# EAGLE schematic led_2 (EAGLE 9.4.1)
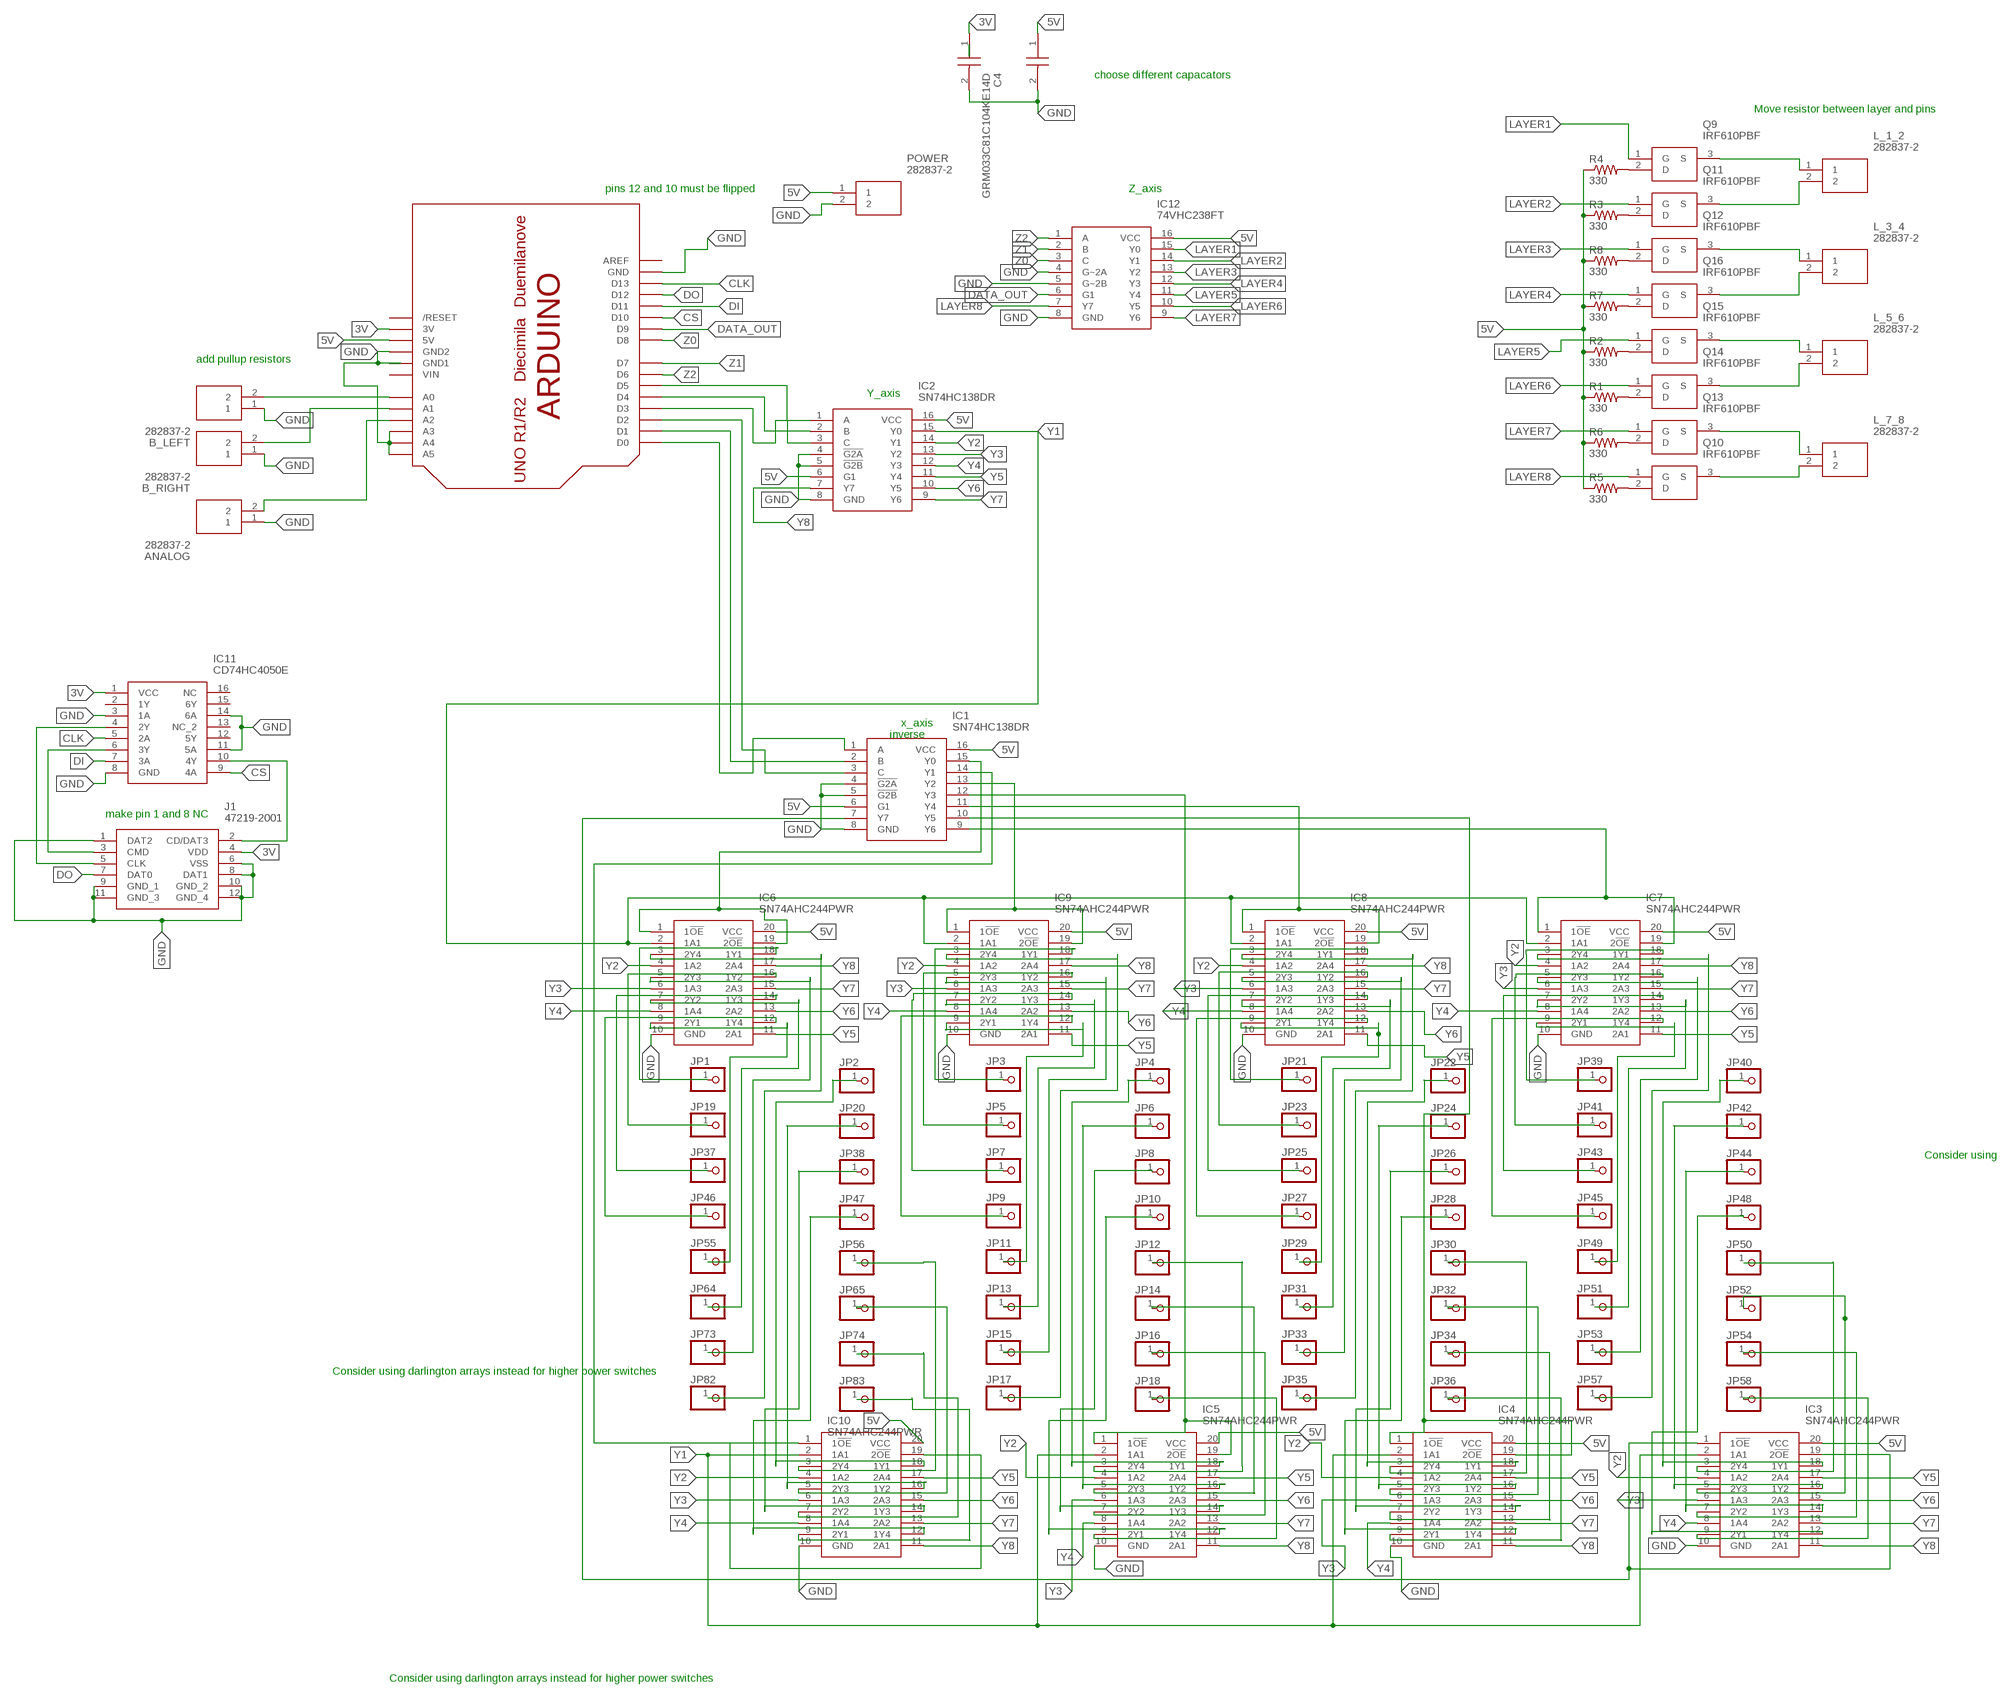
[diagram p0: schematic, sheet 1, part 1 of 2]
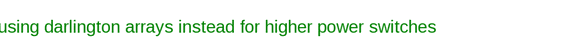
[diagram p1: schematic, sheet 1, part 2 of 2]

## Parts
ANALOG  282837-2  [SHDR2W100P0X508_1X2_1016X820X1]
B_LEFT  282837-2  [SHDR2W100P0X508_1X2_1016X820X1]
B_RIGHT  282837-2  [SHDR2W100P0X508_1X2_1016X820X1]
C4  GRM033C81C104KE14D  [CAPC0603X33N]
C5  GRM033C81C104KE14D  [CAPC0603X33N]
IC1  SN74HC138DR  [SOIC127P600X175-16N]
IC2  SN74HC138DR  [SOIC127P600X175-16N]
IC3  SN74AHC244PWR  [SOP65P640X120-20N]
IC4  SN74AHC244PWR  [SOP65P640X120-20N]
IC5  SN74AHC244PWR  [SOP65P640X120-20N]
IC6  SN74AHC244PWR  [SOP65P640X120-20N]
IC7  SN74AHC244PWR  [SOP65P640X120-20N]
IC8  SN74AHC244PWR  [SOP65P640X120-20N]
IC9  SN74AHC244PWR  [SOP65P640X120-20N]
IC10  SN74AHC244PWR  [SOP65P640X120-20N]
IC11  CD74HC4050E  [DIP254P762X508-16]
IC12  74VHC238FT  [SOP65P640X120-16N]
J1  47219-2001  [472192001]
JP1  PINHD-1X1  [1X01]
JP2  PINHD-1X1  [1X01]
JP3  PINHD-1X1  [1X01]
JP4  PINHD-1X1  [1X01]
JP5  PINHD-1X1  [1X01]
JP6  PINHD-1X1  [1X01]
JP7  PINHD-1X1  [1X01]
JP8  PINHD-1X1  [1X01]
JP9  PINHD-1X1  [1X01]
JP10  PINHD-1X1  [1X01]
JP11  PINHD-1X1  [1X01]
JP12  PINHD-1X1  [1X01]
JP13  PINHD-1X1  [1X01]
JP14  PINHD-1X1  [1X01]
JP15  PINHD-1X1  [1X01]
JP16  PINHD-1X1  [1X01]
JP17  PINHD-1X1  [1X01]
JP18  PINHD-1X1  [1X01]
JP19  PINHD-1X1  [1X01]
JP20  PINHD-1X1  [1X01]
JP21  PINHD-1X1  [1X01]
JP22  PINHD-1X1  [1X01]
JP23  PINHD-1X1  [1X01]
JP24  PINHD-1X1  [1X01]
JP25  PINHD-1X1  [1X01]
JP26  PINHD-1X1  [1X01]
JP27  PINHD-1X1  [1X01]
JP28  PINHD-1X1  [1X01]
JP29  PINHD-1X1  [1X01]
JP30  PINHD-1X1  [1X01]
JP31  PINHD-1X1  [1X01]
JP32  PINHD-1X1  [1X01]
JP33  PINHD-1X1  [1X01]
JP34  PINHD-1X1  [1X01]
JP35  PINHD-1X1  [1X01]
JP36  PINHD-1X1  [1X01]
JP37  PINHD-1X1  [1X01]
JP38  PINHD-1X1  [1X01]
JP39  PINHD-1X1  [1X01]
JP40  PINHD-1X1  [1X01]
JP41  PINHD-1X1  [1X01]
JP42  PINHD-1X1  [1X01]
JP43  PINHD-1X1  [1X01]
JP44  PINHD-1X1  [1X01]
JP45  PINHD-1X1  [1X01]
JP46  PINHD-1X1  [1X01]
JP47  PINHD-1X1  [1X01]
JP48  PINHD-1X1  [1X01]
JP49  PINHD-1X1  [1X01]
JP50  PINHD-1X1  [1X01]
JP51  PINHD-1X1  [1X01]
JP52  PINHD-1X1  [1X01]
JP53  PINHD-1X1  [1X01]
JP54  PINHD-1X1  [1X01]
JP55  PINHD-1X1  [1X01]
JP56  PINHD-1X1  [1X01]
JP57  PINHD-1X1  [1X01]
JP58  PINHD-1X1  [1X01]
JP64  PINHD-1X1  [1X01]
JP65  PINHD-1X1  [1X01]
JP73  PINHD-1X1  [1X01]
JP74  PINHD-1X1  [1X01]
JP82  PINHD-1X1  [1X01]
JP83  PINHD-1X1  [1X01]
L_1_2  282837-2  [SHDR2W100P0X508_1X2_1016X820X1]
L_3_4  282837-2  [SHDR2W100P0X508_1X2_1016X820X1]
L_5_6  282837-2  [SHDR2W100P0X508_1X2_1016X820X1]
L_7_8  282837-2  [SHDR2W100P0X508_1X2_1016X820X1]
POWER  282837-2  [SHDR2W100P0X508_1X2_1016X820X1]
Q9  IRF610PBF  [TO254P465X1024X2050-3P]
Q10  IRF610PBF  [TO254P465X1024X2050-3P]
Q11  IRF610PBF  [TO254P465X1024X2050-3P]
Q12  IRF610PBF  [TO254P465X1024X2050-3P]
Q13  IRF610PBF  [TO254P465X1024X2050-3P]
Q14  IRF610PBF  [TO254P465X1024X2050-3P]
Q15  IRF610PBF  [TO254P465X1024X2050-3P]
Q16  IRF610PBF  [TO254P465X1024X2050-3P]
R1  330  R-US_0207/12  [0207/12]
R2  330  R-US_0207/12  [0207/12]
R3  330  R-US_0207/12  [0207/12]
R4  330  R-US_0207/12  [0207/12]
R5  330  R-US_0207/12  [0207/12]
R6  330  R-US_0207/12  [0207/12]
R7  330  R-US_0207/12  [0207/12]
R8  330  R-US_0207/12  [0207/12]
U$2  ARDUINO-NOHOLE  [ARDUINO-NOHOLE]

## Nets
3V: C4.1 IC11.1(VCC) J1.4(VDD) U$2.3V
5V [VCC]: C5.1 IC1.6(G1) IC1.16(VCC) IC2.6(G1) IC2.16(VCC) IC3.20(VCC) IC4.20(VCC) IC5.20(VCC) IC6.20(VCC) IC7.20(VCC) IC8.20(VCC) IC9.20(VCC) IC10.20(VCC) IC12.16(VCC) POWER.1 R1.1 R2.1 R3.1 R4.1 R5.1 R6.1 R7.1 R8.1 U$2.5V
CLK: IC11.5(2A) U$2.D13
CS: IC11.9(4A) U$2.D10
DATA_OUT: IC12.6(G1) U$2.D9
DI: IC11.7(3A) U$2.D11
DO: J1.7(DAT0) U$2.D12
GND: ANALOG.1 B_LEFT.1 B_RIGHT.1 C4.2 C5.2 IC1.4(!G2A) IC1.5(!G2B) IC1.8(GND) IC2.4(!G2A) IC2.5(!G2B) IC2.8(GND) IC3.10(GND) IC4.10(GND) IC5.10(GND) IC6.10(GND) IC7.10(GND) IC8.10(GND) IC9.10(GND) IC10.10(GND) IC11.3(1A) IC11.8(GND) IC11.11(5A) IC11.14(6A) IC12.4(G~2A) IC12.5(G~2B) IC12.8(GND) J1.1(DAT2) J1.6(VSS) J1.8(DAT1) J1.9(GND_1) J1.10(GND_2) J1.11(GND_3) J1.12(GND_4) POWER.2 U$2.A3 U$2.A4 U$2.A5 U$2.GND U$2.GND1 U$2.GND2
LAYER1: IC12.15(Y0) Q9.1(G)
LAYER2: IC12.14(Y1) Q11.1(G)
LAYER3: IC12.13(Y2) Q12.1(G)
LAYER4: IC12.12(Y3) Q16.1(G)
LAYER5: IC12.11(Y4) Q15.1(G)
LAYER6: IC12.10(Y5) Q14.1(G)
LAYER7: IC12.9(Y6) Q13.1(G)
LAYER8: IC12.7(Y7) Q10.1(G)
N$1: IC1.9(Y6) IC7.1(1!OE) IC7.19(2!OE)
N$2: IC2.3(C) U$2.D5
N$3: IC6.18(1Y1) JP1.1
N$4: IC2.2(B) U$2.D4
N$5 [VCC]: IC6.16(1Y2) JP19.1
N$6 [VCC]: IC6.14(1Y3) JP37.1
N$7 [VCC]: IC6.12(1Y4) JP46.1
N$8 [VCC]: IC6.9(2Y1) JP55.1
N$9 [VCC]: IC6.7(2Y2) JP64.1
N$10 [VCC]: IC6.5(2Y3) JP73.1
N$11: IC2.1(A) U$2.D3
N$12: IC1.3(C) U$2.D2
N$13: IC1.2(B) U$2.D1
N$14: IC1.1(A) U$2.D0
N$15: B_LEFT.2 U$2.A0
N$16: Q9.2(D) R4.2
N$17: Q11.2(D) R3.2
N$18: Q12.2(D) R8.2
N$19: Q16.2(D) R7.2
N$20: Q15.2(D) R2.2
N$21: Q14.2(D) R1.2
N$22: Q13.2(D) R6.2
N$23: Q10.2(D) R5.2
N$24: L_1_2.1 Q9.3(S)
N$25: L_1_2.2 Q11.3(S)
N$26: L_3_4.1 Q12.3(S)
N$27: L_3_4.2 Q16.3(S)
N$28: L_5_6.1 Q15.3(S)
N$29: L_5_6.2 Q14.3(S)
N$30: L_7_8.1 Q13.3(S)
N$31: L_7_8.2 Q10.3(S)
N$32 [VCC]: IC6.3(2Y4) JP82.1
N$33 [VCC]: IC10.18(1Y1) JP2.1
N$34 [VCC]: IC10.16(1Y2) JP20.1
N$35 [VCC]: IC10.14(1Y3) JP38.1
N$36 [VCC]: IC10.12(1Y4) JP47.1
N$37 [VCC]: IC10.3(2Y4) JP56.1
N$38 [VCC]: IC10.5(2Y3) JP65.1
N$39 [VCC]: IC10.7(2Y2) JP74.1
N$40 [VCC]: IC10.9(2Y1) JP83.1
N$41 [VCC]: IC9.18(1Y1) JP3.1
N$42 [VCC]: IC9.16(1Y2) JP5.1
N$43 [VCC]: IC9.14(1Y3) JP7.1
N$44 [VCC]: IC9.12(1Y4) JP9.1
N$45 [VCC]: IC9.9(2Y1) JP11.1
N$46 [VCC]: IC9.7(2Y2) JP13.1
N$47 [VCC]: IC9.5(2Y3) JP15.1
N$48 [VCC]: IC9.3(2Y4) JP17.1
N$49 [VCC]: IC5.18(1Y1) JP4.1
N$50 [VCC]: IC5.16(1Y2) JP6.1
N$51 [VCC]: IC5.14(1Y3) JP8.1
N$52 [VCC]: IC5.12(1Y4) JP10.1
N$53: IC5.3(2Y4) JP12.1
N$54 [VCC]: IC5.5(2Y3) JP14.1
N$55 [VCC]: IC5.7(2Y2) JP16.1
N$56 [VCC]: IC5.9(2Y1) JP18.1
N$57: IC8.18(1Y1) JP21.1
N$58 [VCC]: IC8.16(1Y2) JP23.1
N$59 [VCC]: IC8.14(1Y3) JP25.1
N$60 [VCC]: IC8.12(1Y4) JP27.1
N$61 [VCC]: IC8.9(2Y1) JP29.1
N$62 [VCC]: IC8.7(2Y2) JP31.1
N$63 [VCC]: IC8.5(2Y3) JP33.1
N$64 [VCC]: IC8.3(2Y4) JP35.1
N$65 [VCC]: IC4.18(1Y1) JP22.1
N$66 [VCC]: IC4.16(1Y2) JP24.1
N$67 [VCC]: IC4.14(1Y3) JP26.1
N$68 [VCC]: IC4.12(1Y4) JP28.1
N$69 [VCC]: IC4.3(2Y4) JP30.1
N$70 [VCC]: IC4.5(2Y3) JP32.1
N$71 [VCC]: IC4.7(2Y2) JP34.1
N$72 [VCC]: IC4.9(2Y1) JP36.1
N$73 [VCC]: IC7.18(1Y1) JP39.1
N$74 [VCC]: IC7.16(1Y2) JP41.1
N$75 [VCC]: IC7.14(1Y3) JP43.1
N$76 [VCC]: IC7.12(1Y4) JP45.1
N$77 [VCC]: IC7.9(2Y1) JP49.1
N$78 [VCC]: IC7.7(2Y2) JP51.1
N$79 [VCC]: IC7.5(2Y3) JP53.1
N$80 [VCC]: IC7.3(2Y4) JP57.1
N$81 [VCC]: IC3.18(1Y1) JP40.1
N$82 [VCC]: IC3.16(1Y2) JP42.1
N$83 [VCC]: IC3.14(1Y3) JP44.1
N$84 [VCC]: IC3.12(1Y4) JP48.1
N$85 [VCC]: IC3.3(2Y4) JP50.1
N$86 [VCC]: IC3.5(2Y3) JP52.1
N$87 [VCC]: IC3.7(2Y2) JP54.1
N$88 [VCC]: IC3.9(2Y1) JP58.1
N$89: IC1.15(Y0) IC6.1(1!OE) IC6.19(2!OE)
N$90: IC1.13(Y2) IC9.1(1!OE) IC9.19(2!OE)
N$91: IC1.11(Y4) IC8.1(1!OE) IC8.19(2!OE)
N$92: IC1.14(Y1) IC10.1(1!OE) IC10.19(2!OE)
N$93: IC1.7(Y7) IC3.1(1!OE) IC3.19(2!OE)
N$94: IC1.12(Y3) IC5.1(1!OE) IC5.19(2!OE)
N$95: IC1.10(Y5) IC4.1(1!OE) IC4.19(2!OE)
N$97: ANALOG.2 U$2.A2
N$98: IC11.6(3Y) J1.3(CMD)
N$99: IC11.4(2Y) J1.5(CLK)
N$100: IC11.10(4Y) J1.2(CD/DAT3)
N$102: B_RIGHT.2 U$2.A1
Y1: IC2.15(Y0) IC3.2(1A1) IC4.2(1A1) IC5.2(1A1) IC6.2(1A1) IC7.2(1A1) IC8.2(1A1) IC9.2(1A1) IC10.2(1A1)
Y2: IC2.14(Y1) IC3.4(1A2) IC4.4(1A2) IC5.4(1A2) IC6.4(1A2) IC7.4(1A2) IC8.4(1A2) IC9.4(1A2) IC10.4(1A2)
Y3: IC2.13(Y2) IC3.6(1A3) IC4.6(1A3) IC5.6(1A3) IC6.6(1A3) IC7.6(1A3) IC8.6(1A3) IC9.6(1A3) IC10.6(1A3)
Y4: IC2.12(Y3) IC3.8(1A4) IC4.8(1A4) IC5.8(1A4) IC6.8(1A4) IC7.8(1A4) IC8.8(1A4) IC9.8(1A4) IC10.8(1A4)
Y5: IC2.11(Y4) IC3.17(2A4) IC4.17(2A4) IC5.17(2A4) IC6.11(2A1) IC7.11(2A1) IC8.11(2A1) IC9.11(2A1) IC10.17(2A4)
Y6: IC2.10(Y5) IC3.15(2A3) IC4.15(2A3) IC5.15(2A3) IC6.13(2A2) IC7.13(2A2) IC8.13(2A2) IC9.13(2A2) IC10.15(2A3)
Y7: IC2.9(Y6) IC3.13(2A2) IC4.13(2A2) IC5.13(2A2) IC6.15(2A3) IC7.15(2A3) IC8.15(2A3) IC9.15(2A3) IC10.13(2A2)
Y8: IC2.7(Y7) IC3.11(2A1) IC4.11(2A1) IC5.11(2A1) IC6.17(2A4) IC7.17(2A4) IC8.17(2A4) IC9.17(2A4) IC10.11(2A1)
Z0: IC12.3(C) U$2.D8
Z1: IC12.2(B) U$2.D7
Z2: IC12.1(A) U$2.D6
Unconnected: IC11.2(1Y) IC11.12(5Y) IC11.13(NC_2) IC11.15(6Y) IC11.16(NC) U$2.AREF U$2.RESET(/RESET)

## Notes on the sheet
- choose different capacators
- Move resistor between layer and pins
- pins 12 and 10 must be flipped | Z_axis
- add pullup resistors
- Y_axis
- x_axis
- inverse
- make pin 1 and 8 NC
- Consider using darlington arrays instead for higher power switches
- Consider using darlington arrays instead for higher power switches
- Consider using darlington arrays instead for higher power switches

## Power pins joined to a net without a drawn wire
VIN: U$2.VIN

## Library data of the parts
ANALOG B_LEFT B_RIGHT L_1_2 L_3_4 L_5_6 L_7_8 POWER = SamacSys_Parts:282837-2: Termi-Block 2 way pcb TE Connectivity Buchanan Series 5.08mm Pitch Straight PCB Terminal Block with Cage Clamp, Screw Termination Source: Datasheet <https://componentsearchengine.com/Datasheets/1/282837-2.pdf>; DESCRIPTION: Termi-Block 2 way pcb TE Connectivity Buchanan Series 5.08mm Pitch Straight PCB Terminal Block with Cage Clamp, Screw Termination; HEIGHT: 10.3mm; MANUFACTURER_NAME: TE Connectivity; MANUFACTURER_PART_NUMBER: 282837-2; MOUSER_PART_NUMBER: 571-2828372; MOUSER_PRICE-STOCK: https://www.mouser.com/Search/Refine.aspx?Keyword=571-2828372
C4 C5 = SamacSys_Parts:GRM033C81C104KE14D: Multilayer Ceramic Capacitors MLCC - SMD/SMT .1UF 16V 10% 0201 Source: Datasheet <https://componentsearchengine.com/Datasheets/1/GRM033C81C104KE14D.pdf>; DESCRIPTION: Multilayer Ceramic Capacitors MLCC - SMD/SMT .1UF 16V 10% 0201; HEIGHT: 0.33mm; MANUFACTURER_NAME: Murata Electronics; MANUFACTURER_PART_NUMBER: GRM033C81C104KE14D; MOUSER_PART_NUMBER: 81-GRM033C81C104KE4D; MOUSER_PRICE-STOCK: https://www.mouser.com/Search/Refine.aspx?Keyword=81-GRM033C81C104KE4D
IC1 IC2 = SamacSys_Parts:SN74HC138DR: 3-Line To 8-Line Decoders/Demultiplexers Source: Datasheet <http://www.ti.com/lit/ds/symlink/sn74hc138.pdf>; DESCRIPTION: 3-Line To 8-Line Decoders/Demultiplexers; HEIGHT: 1.75mm; MANUFACTURER_NAME: Texas Instruments; MANUFACTURER_PART_NUMBER: SN74HC138DR; MOUSER_PART_NUMBER: 595-SN74HC138DR; MOUSER_PRICE-STOCK: https://www.mouser.com/Search/Refine.aspx?Keyword=595-SN74HC138DR
IC3-IC10 = SamacSys_Parts:SN74AHC244PWR: Texas Instruments SN74AHC244PWR Octal Buffer & Line Driver, 3-State, 2 5.5 V, 20-Pin TSSOP Source: Datasheet <http://www.ti.com/lit/gpn/sn74ahc244>; DESCRIPTION: Texas Instruments SN74AHC244PWR Octal Buffer & Line Driver, 3-State, 2 5.5 V, 20-Pin TSSOP; HEIGHT: 1.2mm; MANUFACTURER_NAME: Texas Instruments; MANUFACTURER_PART_NUMBER: SN74AHC244PWR; MOUSER_PART_NUMBER: 595-SN74AHC244PWR; MOUSER_PRICE-STOCK: https://www.mouser.com/Search/Refine.aspx?Keyword=595-SN74AHC244PWR
IC11 = SamacSys_Parts:CD74HC4050E: High-Speed CMOS Logic Hex Buffers, Inverting and Non-Inverting Source: Datasheet <http://www.ti.com/lit/gpn/cd74hc4050>; DESCRIPTION: High-Speed CMOS Logic Hex Buffers, Inverting and Non-Inverting; HEIGHT: mm; MANUFACTURER_NAME: Texas Instruments; MANUFACTURER_PART_NUMBER: CD74HC4050E; MOUSER_PART_NUMBER: 595-CD74HC4050E; MOUSER_PRICE-STOCK: https://www.mouser.com/Search/Refine.aspx?Keyword=595-CD74HC4050E
IC12 = SamacSys_Parts:74VHC238FT: Encoders, Decoders, Multiplexers & Demultiplexers CMOS Logic IC 5.5ns 8mA 2.0V-5.5V Source: Datasheet <https://mouser.componentsearchengine.com/Datasheets/1/74VHC238FT.pdf>; DESCRIPTION: Encoders, Decoders, Multiplexers & Demultiplexers CMOS Logic IC 5.5ns 8mA 2.0V-5.5V; HEIGHT: 1.2mm; MANUFACTURER_NAME: Toshiba; MANUFACTURER_PART_NUMBER: 74VHC238FT
J1 = SamacSys_Parts:47219-2001: Molex 47219 Series 8 Way Horizontal Hinged Micro SD Memory Card Connector with Solder Termination Source: Datasheet <https://componentsearchengine.com/Datasheets/1/47219-2001.pdf>; DESCRIPTION: Molex 47219 Series 8 Way Horizontal Hinged Micro SD Memory Card Connector with Solder Termination; HEIGHT: mm; MANUFACTURER_NAME: Molex; MANUFACTURER_PART_NUMBER: 47219-2001; MOUSER_PART_NUMBER: 538-47219-2001; MOUSER_PRICE-STOCK: https://www.mouser.com/Search/Refine.aspx?Keyword=538-47219-2001
JP1-JP58 JP64 JP65 JP73 JP74 JP82 JP83 = adafruit:PINHD-1X1: Pin header 1x1 for 0.1" spacing With round pins
Q9-Q16 = SamacSys_Parts:IRF610PBF: IRF610PBF Source: Datasheet <https://componentsearchengine.com/Datasheets/1/IRF610PBF.pdf>; DESCRIPTION: IRF610PBF; HEIGHT: 4.65mm; MANUFACTURER_NAME: Vishay; MANUFACTURER_PART_NUMBER: IRF610PBF; MOUSER_PART_NUMBER: 844-IRF610PBF; MOUSER_PRICE-STOCK: https://www.mouser.com/Search/Refine.aspx?Keyword=844-IRF610PBF
R1-R8 = adafruit:R-US_: RESISTOR, American symbol
U$2 = adafruit:ARDUINO: Arduino Diecimila/Duemilanove Make a shield with ease, this package has all the named pins as well as the two mounting drill holes and an outline of the USB and DC power connector. The outline is on the DIMENSION layer, so if your board house uses it they will cut the outline to match. http://www.ladyada.net/library/pcb/eaglelibrary.html

## Net classes
0 40mA<: width 0.102 mm, drill 0.25 mm, clearance 0.13 mm
1 VCC: width 0.203 mm, drill 0.4 mm, clearance 0.13 mm
2 min: drill 0.22 mm